# EAGLE design buttons (EAGLE 4.16)
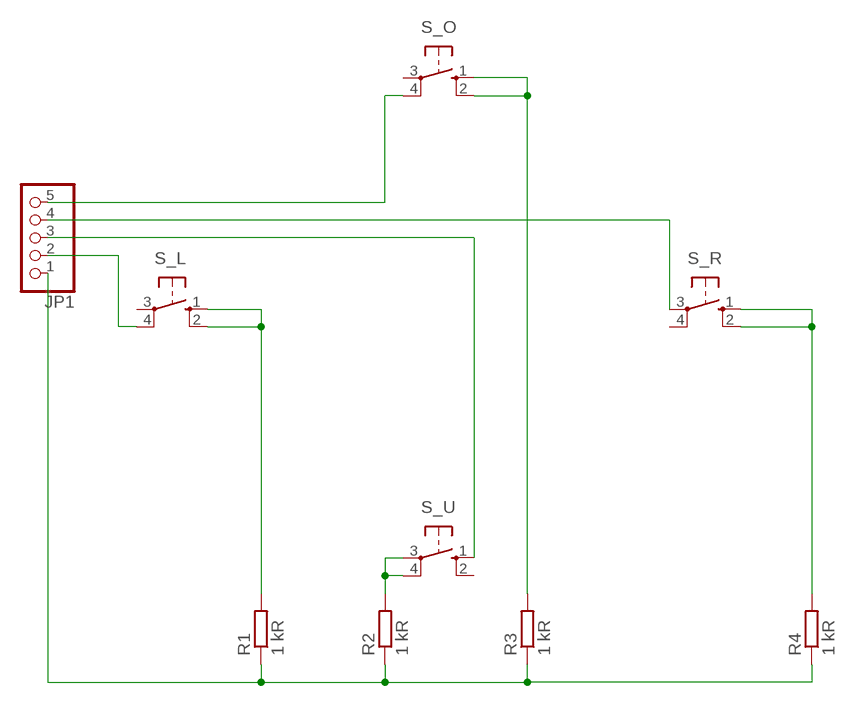
[diagram p0: schematic, sheet 1]

## Parts
JP1  PINHD-1X5  [1X05]
R1  1 kR  R-EU_0207/10  [0207/10]
R2  1 kR  R-EU_0207/10  [0207/10]
R3  1 kR  R-EU_0207/10  [0207/10]
R4  1 kR  R-EU_0207/10  [0207/10]
S_L  10-XX  [B3F-10XX]
S_O  10-XX  [B3F-10XX]
S_R  10-XX  [B3F-10XX]
S_U  10-XX  [B3F-10XX]

## Nets
GND: JP1.1 R1.1 R2.1 R3.1 R4.1
N$4: JP1.4 S_R.3(P)
N$7: R1.2 S_L.1(S) S_L.2(S1)
N$8: JP1.5 S_O.4(P1)
N$9: JP1.3 S_U.1(S)
N$10: R2.2 S_U.3(P) S_U.4(P1)
N$11: R3.2 S_O.1(S) S_O.2(S1)
N$12: R4.2 S_R.1(S) S_R.2(S1)
S_L: JP1.2 S_L.4(P1)
Unconnected: S_L.3(P) S_O.3(P) S_R.4(P1) S_U.2(S1)

## Library data of the parts
JP1 = pinhead:PINHD-1X5: PIN HEADER
R1-R4 = rcl:R-EU_: RESISTOR, European symbol
S_L S_O S_R S_U = switch-omron:10-XX: OMRON SWITCH

## Board
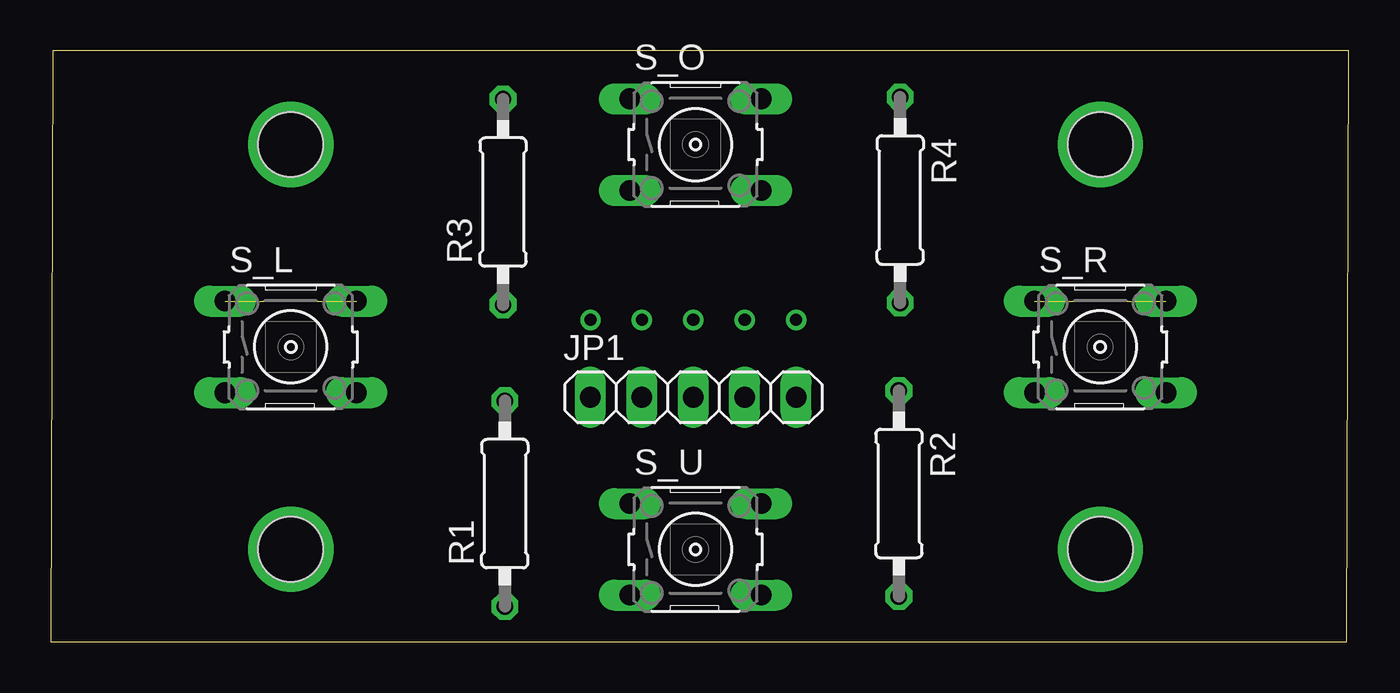
[diagram p1: board, top side]
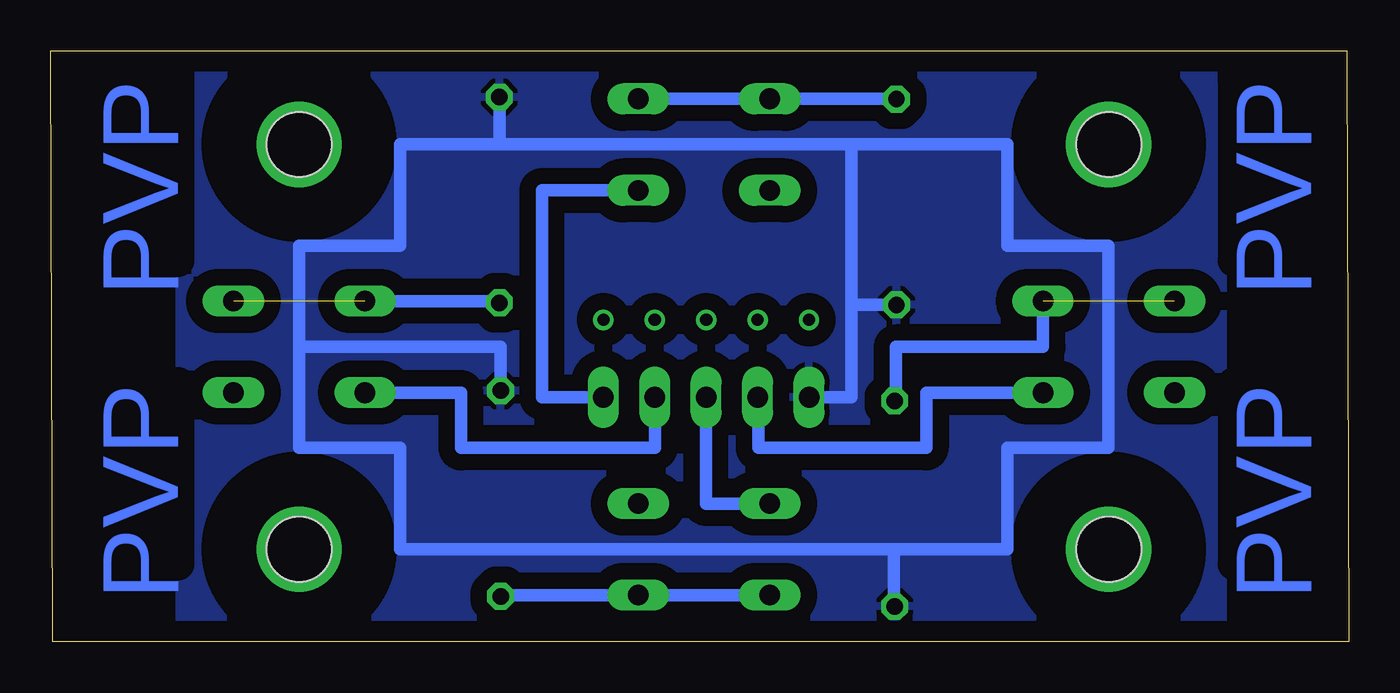
[diagram p2: board, bottom side, seen from below]

Size 64.16 x 29.21 mm. Coordinates in mm from the lower left corner, seen from the top.
Outline: 0,0 64.06,0 64.16,29.21 0.1,29.21 0,0
Copper layers (1*16): Top 0.035mm / dielectric 1.5mm / Bottom 0.035mm
Design rules "default": minimum track width 10mil, minimum drill 24mil, track to track 8mil, track to pad 8mil, pad to pad 8mil, via to via 8mil, smd to smd 8mil, copper to edge 40mil, drill to drill 8mil, minimum pad ring 10mil, minimum via ring 8mil, stop-mask expansion 4mil, vias tented up to drill 0mil, thermal gap 10mil
Holes 3.2 mm at 51.87,4.57 11.87,4.57 11.87,24.57 51.87,24.57
bRestrict: area 8.9,1.6 to 14.9,7.6; area 8.9,21.6 to 14.9,27.6; area 48.9,21.6 to 54.9,27.6; area 48.9,1.6 to 54.9,7.6

### Footprints (pad centres in the part's own frame; a part is rotated, then mirrored left to right if it is on the bottom)
1X05 = drill 1.016 long: 1 -5.08,0; 2 -2.54,0; 3 0,0; 4 2.54,0; 5 5.08,0
0207/10 = drill 0.813 octagon: 1 -5.08,0; 2 5.08,0
B3F-10XX = drill 1.016 long: 1 -3.251,2.261; 2 3.251,2.261; 3 -3.251,-2.261; 4 3.251,-2.261

### Placement (x,y rotation side)
JP1  31.76,12.09 0 top
R1  22.45,6.83 90 top
R2  41.92,7.33 270 top
R3  22.36,21.73 90 top
R4  41.98,21.83 270 top
S_L  11.87,14.57 0 top
S_O  31.87,24.57 0 top
S_R  51.87,14.57 0 top
S_U  31.87,4.57 0 top

### Tracks (layer width: path | path; a pad name or v marks a point on that pad's centre or on a via)
GND
  Bottom 0.61: 11.88,14.58 11.88,9.58 16.88,9.58 16.88,4.58 22.48,4.58 | 11.88,14.58 11.88,16.83 | 22.48,4.58 46.88,4.58 46.88,9.58 51.88,9.58 51.88,14.58 | 51.88,14.58 51.88,19.58 46.88,19.58 46.88,24.58 41.88,24.58 | 24.58,24.58 41.88,24.58 | 24.58,24.58 16.88,24.58 16.88,19.58 11.88,19.58 11.88,14.58 | JP1.1 24.58,12.09 24.58,18.78 | 24.58,24.58 24.58,18.78 | R3.1 24.58,16.65 24.58,18.78 | R1.1 22.48,1.75 22.48,4.58 | R2.1 41.92,14.58 51.88,14.58 | R4.1 41.98,24.58 41.88,24.58
  pour Bottom (isolate 0.813): 6.2,29.35 57.8,29.35 57.8,0.66 6.2,0.66
N$1  (via drill 0.6)
  other vias: 26.68,15.91
N$2  (via drill 0.6)
  other vias: 29.22,15.91
N$3  (via drill 0.6)
  other vias: 31.76,15.91
N$4
  Bottom 0.61: JP1.4 34.28,12.09 34.28,9.58 43.88,9.58 43.88,12.31 S_R.3
N$5  (via drill 0.6)
  other vias: 34.3,15.91
N$6  (via drill 0.6)
  other vias: 36.84,15.91
N$7  (1 unrouted)
  Bottom 0.406: 22.38,11.91 22.38,11.88
  Bottom 0.61: S_L.2 15.12,14.58 22.38,14.58 22.38,11.91 R1.2
N$8
  Bottom 0.61: S_O.4 39.88,22.31 39.88,12.08 JP1.5
N$9
  Bottom 0.61: JP1.3 31.78,12.09 31.78,6.83 S_U.1
N$10
  Bottom 0.406: S_U.4 35.88,2.31 | R2.2 41.88,2.25 41.88,2.31
  Bottom 0.61: S_U.3 S_U.4 | 35.88,2.31 41.88,2.31
N$11
  Bottom 0.406: S_O.1 28.58,26.83
  Bottom 0.61: S_O.2 S_O.1 22.38,26.83 22.38,26.81 | 22.38,26.81 22.38,26.78 | R3.2 22.38,26.81
N$12  (1 unrouted)
  Bottom 0.406: R4.2 41.98,16.83 42.18,16.88
  Bottom 0.61: 41.98,16.83 S_R.1
S$1  (via drill 3.2)
  other vias: 11.88,24.58
S$2  (via drill 3.2)
  other vias: 11.88,4.58
S$3  (via drill 3.2)
  other vias: 51.88,4.58
S$4  (via drill 3.2)
  other vias: 51.88,24.58
S_L
  Bottom 0.61: JP1.2 29.18,12.09 29.18,9.58 20.88,9.58 20.88,12.31 S_L.4

### Text on the board
Bottom: PVP | PVP | PVP | PVP